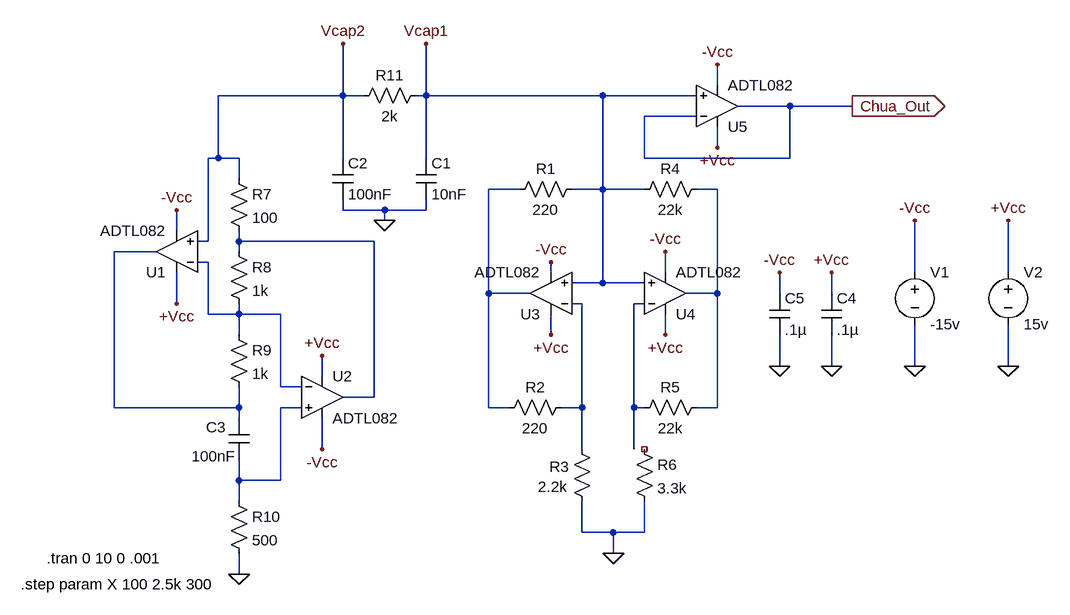
[diagram p0: schematic Chua.asc]
Chua.asc, the LTspice schematic file:
Version 4.1
SHEET 1 1368 680
WIRE 848 -224 848 -256
WIRE 272 -208 272 -288
WIRE 272 -208 80 -208
WIRE 304 -208 272 -208
WIRE 400 -208 400 -288
WIRE 400 -208 384 -208
WIRE 672 -208 400 -208
WIRE 816 -208 672 -208
WIRE 960 -192 880 -192
WIRE 1056 -192 960 -192
WIRE 816 -176 736 -176
WIRE 848 -128 848 -160
WIRE 80 -112 80 -208
WIRE 80 -112 64 -112
WIRE 112 -112 80 -112
WIRE 272 -112 272 -208
WIRE 400 -112 400 -208
WIRE 736 -112 736 -176
WIRE 960 -112 960 -192
WIRE 960 -112 736 -112
WIRE 112 -80 112 -112
WIRE 544 -64 496 -64
WIRE 672 -64 672 -208
WIRE 672 -64 624 -64
WIRE 736 -64 672 -64
WIRE 848 -64 816 -64
WIRE 272 -32 272 -48
WIRE 336 -32 272 -32
WIRE 400 -32 400 -48
WIRE 400 -32 336 -32
WIRE 336 -16 336 -32
WIRE 16 0 16 -32
WIRE 64 16 64 -112
WIRE 64 16 48 16
WIRE 112 16 112 0
WIRE 320 16 112 16
WIRE -16 32 -80 32
WIRE 112 32 112 16
WIRE 64 48 48 48
WIRE 592 64 592 48
WIRE 768 64 768 32
WIRE 1152 64 1152 -16
WIRE 1296 64 1296 -16
WIRE 672 80 672 -64
WIRE 672 80 624 80
WIRE 736 80 672 80
WIRE 496 96 496 -64
WIRE 560 96 496 96
WIRE 848 96 848 -64
WIRE 848 96 800 96
WIRE 944 96 944 64
WIRE 1024 96 1024 64
WIRE 16 112 16 64
WIRE 640 112 624 112
WIRE 736 112 720 112
WIRE 64 128 64 48
WIRE 112 128 112 112
WIRE 112 128 64 128
WIRE 176 128 112 128
WIRE 112 160 112 128
WIRE 592 160 592 128
WIRE 768 160 768 128
WIRE 944 208 944 160
WIRE 1024 208 1024 160
WIRE 1152 208 1152 144
WIRE 1296 208 1296 144
WIRE 240 224 240 192
WIRE 176 240 176 128
WIRE 208 240 176 240
WIRE 320 256 320 16
WIRE 320 256 272 256
WIRE -80 272 -80 32
WIRE 112 272 112 240
WIRE 112 272 -80 272
WIRE 208 272 176 272
WIRE 496 272 496 96
WIRE 528 272 496 272
WIRE 640 272 640 112
WIRE 640 272 608 272
WIRE 720 272 720 112
WIRE 736 272 720 272
WIRE 848 272 848 96
WIRE 848 272 816 272
WIRE 112 288 112 272
WIRE 240 336 240 288
WIRE 640 336 640 272
WIRE 720 336 720 272
WIRE 112 384 112 352
WIRE 176 384 176 272
WIRE 176 384 112 384
WIRE 112 416 112 384
WIRE 640 464 640 416
WIRE 688 464 640 464
WIRE 736 464 736 416
WIRE 736 464 688 464
WIRE 688 496 688 464
WIRE 112 528 112 496
FLAG 112 528 0
FLAG 336 -16 0
FLAG 688 496 0
FLAG 1056 -192 Chua_Out
IOPIN 1056 -192 Out
FLAG 1024 208 0
FLAG 1024 64 +Vcc
FLAG 1152 208 0
FLAG 1152 -16 -Vcc
FLAG 944 208 0
FLAG 944 64 -Vcc
FLAG 1296 208 0
FLAG 1296 -16 +Vcc
FLAG 592 160 +Vcc
FLAG 768 160 +Vcc
FLAG 848 -128 +Vcc
FLAG 16 112 +Vcc
FLAG 240 192 +Vcc
FLAG 768 32 -Vcc
FLAG 848 -256 -Vcc
FLAG 16 -32 -Vcc
FLAG 240 336 -Vcc
FLAG 592 48 -Vcc
FLAG 400 -288 Vcap1
FLAG 272 -288 Vcap2
SYMBOL OpAmps\\ADTL082 16 96 R180
SYMATTR InstName U1
SYMBOL OpAmps\\ADTL082 240 192 R0
SYMATTR InstName U2
SYMBOL OpAmps\\ADTL082 592 160 R180
SYMATTR InstName U3
SYMBOL OpAmps\\ADTL082 768 160 M180
SYMATTR InstName U4
SYMBOL OpAmps\\ADTL082 848 -128 M180
SYMATTR InstName U5
SYMBOL res 640 -80 R90
WINDOW 0 0 56 VBottom 2
WINDOW 3 32 56 VTop 2
SYMATTR InstName R1
SYMATTR Value 220
SYMATTR SpiceLine tol=1
SYMBOL res 512 288 R270
WINDOW 0 32 56 VTop 2
WINDOW 3 0 56 VBottom 2
SYMATTR InstName R2
SYMATTR Value 220
SYMATTR SpiceLine tol=1
SYMBOL res 624 320 R0
WINDOW 0 -34 43 Left 2
WINDOW 3 -52 74 Left 2
SYMATTR InstName R3
SYMATTR Value 2.2k
SYMBOL res 832 -80 R90
WINDOW 0 0 56 VBottom 2
WINDOW 3 32 56 VTop 2
SYMATTR InstName R4
SYMATTR Value 22k
SYMATTR SpiceLine tol=1
SYMBOL res 832 256 R90
WINDOW 0 0 56 VBottom 2
WINDOW 3 32 56 VTop 2
SYMATTR InstName R5
SYMATTR Value 22k
SYMATTR SpiceLine tol=1
SYMBOL res 96 -96 R0
SYMATTR InstName R7
SYMATTR Value 100
SYMATTR SpiceLine tol=1
SYMBOL res 96 16 R0
SYMATTR InstName R8
SYMATTR Value 1k
SYMATTR SpiceLine tol=1
SYMBOL res 96 144 R0
SYMATTR InstName R9
SYMATTR Value 1k
SYMATTR SpiceLine tol=1
SYMBOL cap 384 -112 R0
SYMATTR InstName C1
SYMATTR Value 10nF
SYMBOL cap 96 288 R0
WINDOW 0 -35 14 Left 2
WINDOW 3 -57 59 Left 2
SYMATTR InstName C3
SYMATTR Value 100nF
SYMBOL res 96 400 R0
SYMATTR InstName R10
SYMATTR Value 500
SYMATTR SpiceLine tol=1
SYMBOL res 400 -224 R90
WINDOW 0 0 56 VBottom 2
WINDOW 3 32 56 VTop 2
SYMATTR InstName R11
SYMATTR Value 2k
SYMATTR SpiceLine tol=1
SYMBOL cap 256 -112 R0
SYMATTR InstName C2
SYMATTR Value 100nF
SYMBOL cap 1008 96 R0
SYMATTR InstName C4
SYMATTR Value .1µ
SYMBOL voltage 1152 48 R0
WINDOW 123 0 0 Left 0
WINDOW 39 0 0 Left 0
SYMATTR InstName V1
SYMATTR Value -15v
SYMBOL cap 928 96 R0
SYMATTR InstName C5
SYMATTR Value .1µ
SYMBOL voltage 1296 48 R0
WINDOW 123 0 0 Left 0
WINDOW 39 0 0 Left 0
SYMATTR InstName V2
SYMATTR Value 15v
SYMBOL res 720 320 R0
SYMATTR InstName R6
SYMATTR Value 3.3k
TEXT -184 504 Left 2 !.tran 0 10 0 .001
TEXT -224 544 Left 2 !.step param X 100 2.5k 300

The netlist it stands for:
* Chua.asc
X§U1 Vcap2 N005 +Vcc -Vcc N004 ADTL082  ; pins In+ In- V+ V- OUT
X§U2 N008 N005 +Vcc -Vcc N003 ADTL082  ; pins In+ In- V+ V- OUT
X§U3 Vcap1 N006 +Vcc -Vcc N001 ADTL082  ; pins In+ In- V+ V- OUT
X§U4 Vcap1 N007 +Vcc -Vcc N002 ADTL082  ; pins In+ In- V+ V- OUT
X§U5 Vcap1 Chua_Out +Vcc -Vcc Chua_Out ADTL082  ; pins In+ In- V+ V- OUT
R1 Vcap1 N001 220 tol=1
R2 N001 N006 220 tol=1
R3 N006 0 2.2k
R4 N002 Vcap1 22k tol=1
R5 N002 N007 22k tol=1
R7 Vcap2 N003 100 tol=1
R8 N003 N005 1k tol=1
R9 N005 N004 1k tol=1
C1 Vcap1 0 10nF
C3 N004 N008 100nF
R10 N008 0 500 tol=1
R11 Vcap1 Vcap2 2k tol=1
C2 Vcap2 0 100nF
C4 +Vcc 0 .1µ
V1 -Vcc 0 -15v
C5 -Vcc 0 .1µ
V2 +Vcc 0 15v
R6 NC_01 0 3.3k
.tran 0 10 0 .001
.step param X 100 2.5k 300
.lib ADI.lib
.backanno
.end